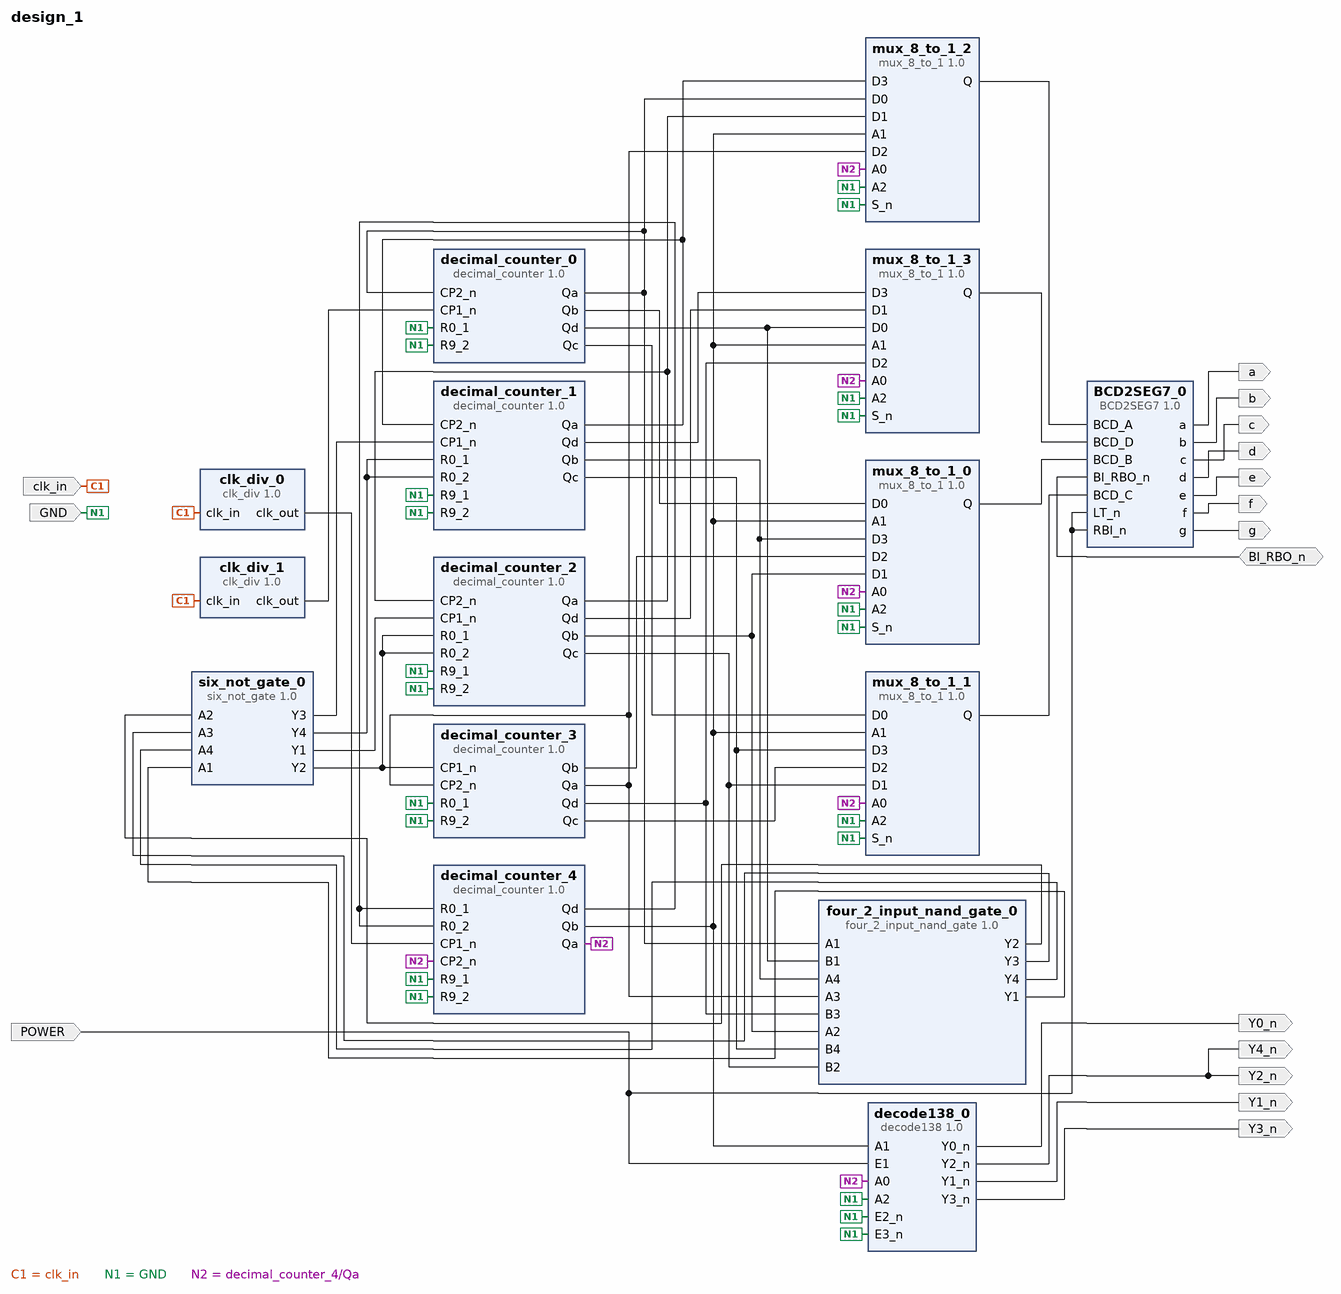
[diagram p0: block diagram of the top level]
# Vivado block design design_1, Vivado 2015.2
create_bd_design design_1

create_bd_port -dir I clk_in
create_bd_port -dir I GND
create_bd_port -dir I POWER
create_bd_port -dir O a
create_bd_port -dir O b
create_bd_port -dir O c
create_bd_port -dir O d
create_bd_port -dir O e
create_bd_port -dir O f
create_bd_port -dir O g
create_bd_port -dir IO BI_RBO_n
create_bd_port -dir O Y0_n
create_bd_port -dir O Y1_n
create_bd_port -dir O Y2_n
create_bd_port -dir O Y4_n
create_bd_port -dir O Y3_n

create_bd_cell -type ip -vlnv xilinx.com:xup:clk_div:1.0 clk_div_0
set_property -dict {CONFIG.N 99999} [get_bd_cells clk_div_0]
create_bd_cell -type ip -vlnv xilinx.com:xup:clk_div:1.0 clk_div_1
set_property -dict {CONFIG.N 99999999} [get_bd_cells clk_div_1]
create_bd_cell -type ip -vlnv xilinx.com:xup:decimal_counter:1.0 decimal_counter_0
create_bd_cell -type ip -vlnv xilinx.com:xup:decimal_counter:1.0 decimal_counter_1
create_bd_cell -type ip -vlnv xilinx.com:xup:decimal_counter:1.0 decimal_counter_2
create_bd_cell -type ip -vlnv xilinx.com:xup:decimal_counter:1.0 decimal_counter_3
create_bd_cell -type ip -vlnv xilinx.com:XUP:four_2_input_nand_gate:1.0 four_2_input_nand_gate_0
create_bd_cell -type ip -vlnv xilinx.com:XUP:six_not_gate:1.0 six_not_gate_0
create_bd_cell -type ip -vlnv xilinx.com:xup:decimal_counter:1.0 decimal_counter_4
create_bd_cell -type ip -vlnv xilinx.com:xup:mux_8_to_1:1.0 mux_8_to_1_0
create_bd_cell -type ip -vlnv xilinx.com:xup:mux_8_to_1:1.0 mux_8_to_1_1
create_bd_cell -type ip -vlnv xilinx.com:xup:mux_8_to_1:1.0 mux_8_to_1_2
create_bd_cell -type ip -vlnv xilinx.com:xup:mux_8_to_1:1.0 mux_8_to_1_3
create_bd_cell -type ip -vlnv xilinx.com:xup:BCD2SEG7:1.0 BCD2SEG7_0
create_bd_cell -type ip -vlnv xilinx.com:XUP:decode138:1.0 decode138_0

# ---- connections ----

connect_bd_net [get_bd_ports clk_in] [get_bd_pins clk_div_0/clk_in] [get_bd_pins clk_div_1/clk_in]
connect_bd_net [get_bd_pins clk_div_1/clk_out] [get_bd_pins decimal_counter_0/CP1_n]
connect_bd_net [get_bd_pins decimal_counter_0/Qa] \
  [get_bd_pins decimal_counter_0/CP2_n] [get_bd_pins mux_8_to_1_2/D0] [get_bd_pins four_2_input_nand_gate_0/A1]
connect_bd_net [get_bd_pins decimal_counter_2/Qa] [get_bd_pins decimal_counter_2/CP2_n] [get_bd_pins mux_8_to_1_2/D1]
connect_bd_net [get_bd_pins decimal_counter_1/Qa] [get_bd_pins decimal_counter_1/CP2_n] [get_bd_pins mux_8_to_1_2/D3]
connect_bd_net -net R0_1_1 [get_bd_ports GND] \
  [get_bd_pins decimal_counter_0/R0_1] [get_bd_pins decimal_counter_0/R9_2] [get_bd_pins decimal_counter_2/R9_2] \
  [get_bd_pins decimal_counter_2/R9_1] [get_bd_pins decimal_counter_3/R0_1] [get_bd_pins decimal_counter_3/R9_2] \
  [get_bd_pins decimal_counter_1/R9_1] [get_bd_pins decimal_counter_1/R9_2] [get_bd_pins decimal_counter_4/R9_2] \
  [get_bd_pins mux_8_to_1_2/A2] [get_bd_pins mux_8_to_1_0/A2] [get_bd_pins mux_8_to_1_1/A2] [get_bd_pins mux_8_to_1_3/A2] \
  [get_bd_pins decode138_0/A2] [get_bd_pins decode138_0/E2_n] [get_bd_pins decode138_0/E3_n] \
  [get_bd_pins decimal_counter_4/R9_1] [get_bd_pins mux_8_to_1_0/S_n] [get_bd_pins mux_8_to_1_2/S_n] \
  [get_bd_pins mux_8_to_1_1/S_n] [get_bd_pins mux_8_to_1_3/S_n]
connect_bd_net [get_bd_pins decimal_counter_0/Qd] [get_bd_pins mux_8_to_1_3/D0] [get_bd_pins four_2_input_nand_gate_0/B1]
connect_bd_net [get_bd_pins four_2_input_nand_gate_0/Y2] [get_bd_pins six_not_gate_0/A2]
connect_bd_net [get_bd_pins four_2_input_nand_gate_0/Y3] [get_bd_pins six_not_gate_0/A3]
connect_bd_net [get_bd_pins decimal_counter_2/Qb] [get_bd_pins four_2_input_nand_gate_0/A2] [get_bd_pins mux_8_to_1_0/D1]
connect_bd_net [get_bd_pins decimal_counter_2/Qc] [get_bd_pins four_2_input_nand_gate_0/B2] [get_bd_pins mux_8_to_1_1/D1]
connect_bd_net [get_bd_pins six_not_gate_0/Y2] \
  [get_bd_pins decimal_counter_3/CP1_n] [get_bd_pins decimal_counter_2/R0_1] [get_bd_pins decimal_counter_2/R0_2]
connect_bd_net [get_bd_pins decimal_counter_3/Qa] \
  [get_bd_pins four_2_input_nand_gate_0/A3] [get_bd_pins decimal_counter_3/CP2_n] [get_bd_pins mux_8_to_1_2/D2]
connect_bd_net [get_bd_pins decimal_counter_3/Qd] [get_bd_pins four_2_input_nand_gate_0/B3] [get_bd_pins mux_8_to_1_3/D2]
connect_bd_net [get_bd_pins six_not_gate_0/Y3] [get_bd_pins decimal_counter_1/CP1_n]
connect_bd_net [get_bd_pins decimal_counter_1/Qb] [get_bd_pins four_2_input_nand_gate_0/A4] [get_bd_pins mux_8_to_1_0/D3]
connect_bd_net [get_bd_pins decimal_counter_1/Qc] [get_bd_pins four_2_input_nand_gate_0/B4] [get_bd_pins mux_8_to_1_1/D3]
connect_bd_net [get_bd_pins four_2_input_nand_gate_0/Y4] [get_bd_pins six_not_gate_0/A4]
connect_bd_net [get_bd_pins six_not_gate_0/Y4] [get_bd_pins decimal_counter_1/R0_1] [get_bd_pins decimal_counter_1/R0_2]
connect_bd_net [get_bd_pins clk_div_0/clk_out] [get_bd_pins decimal_counter_4/CP1_n]
connect_bd_net [get_bd_pins decimal_counter_4/Qa] \
  [get_bd_pins decimal_counter_4/CP2_n] [get_bd_pins mux_8_to_1_2/A0] [get_bd_pins mux_8_to_1_0/A0] \
  [get_bd_pins mux_8_to_1_1/A0] [get_bd_pins mux_8_to_1_3/A0] [get_bd_pins decode138_0/A0]
connect_bd_net [get_bd_pins decimal_counter_4/Qb] \
  [get_bd_pins mux_8_to_1_2/A1] [get_bd_pins mux_8_to_1_0/A1] [get_bd_pins mux_8_to_1_1/A1] [get_bd_pins mux_8_to_1_3/A1] \
  [get_bd_pins decode138_0/A1]
connect_bd_net [get_bd_pins decimal_counter_0/Qb] [get_bd_pins mux_8_to_1_0/D0]
connect_bd_net [get_bd_pins decimal_counter_3/Qb] [get_bd_pins mux_8_to_1_0/D2]
connect_bd_net [get_bd_pins decimal_counter_0/Qc] [get_bd_pins mux_8_to_1_1/D0]
connect_bd_net [get_bd_pins decimal_counter_3/Qc] [get_bd_pins mux_8_to_1_1/D2]
connect_bd_net [get_bd_pins decimal_counter_2/Qd] [get_bd_pins mux_8_to_1_3/D1]
connect_bd_net [get_bd_pins decimal_counter_1/Qd] [get_bd_pins mux_8_to_1_3/D3]
connect_bd_net [get_bd_pins mux_8_to_1_2/Q] [get_bd_pins BCD2SEG7_0/BCD_A]
connect_bd_net [get_bd_pins mux_8_to_1_0/Q] [get_bd_pins BCD2SEG7_0/BCD_B]
connect_bd_net [get_bd_pins mux_8_to_1_1/Q] [get_bd_pins BCD2SEG7_0/BCD_C]
connect_bd_net [get_bd_pins mux_8_to_1_3/Q] [get_bd_pins BCD2SEG7_0/BCD_D]
connect_bd_net -net LT_n_1 [get_bd_ports POWER] [get_bd_pins BCD2SEG7_0/LT_n] [get_bd_pins BCD2SEG7_0/RBI_n] [get_bd_pins decode138_0/E1]
connect_bd_net [get_bd_pins BCD2SEG7_0/a] [get_bd_ports a]
connect_bd_net [get_bd_pins BCD2SEG7_0/b] [get_bd_ports b]
connect_bd_net [get_bd_pins BCD2SEG7_0/c] [get_bd_ports c]
connect_bd_net [get_bd_pins BCD2SEG7_0/d] [get_bd_ports d]
connect_bd_net [get_bd_pins BCD2SEG7_0/e] [get_bd_ports e]
connect_bd_net [get_bd_pins BCD2SEG7_0/f] [get_bd_ports f]
connect_bd_net [get_bd_pins BCD2SEG7_0/g] [get_bd_ports g]
connect_bd_net [get_bd_ports BI_RBO_n] [get_bd_pins BCD2SEG7_0/BI_RBO_n]
connect_bd_net [get_bd_pins decode138_0/Y0_n] [get_bd_ports Y0_n]
connect_bd_net [get_bd_pins decode138_0/Y1_n] [get_bd_ports Y1_n]
connect_bd_net [get_bd_pins decode138_0/Y2_n] [get_bd_ports Y4_n] [get_bd_ports Y2_n]
connect_bd_net [get_bd_pins decode138_0/Y3_n] [get_bd_ports Y3_n]
connect_bd_net [get_bd_pins decimal_counter_4/Qd] [get_bd_pins decimal_counter_4/R0_2] [get_bd_pins decimal_counter_4/R0_1]
connect_bd_net [get_bd_pins four_2_input_nand_gate_0/Y1] [get_bd_pins six_not_gate_0/A1]
connect_bd_net [get_bd_pins six_not_gate_0/Y1] [get_bd_pins decimal_counter_2/CP1_n]

validate_bd_design
save_bd_design
